# EAGLE schematic controller-ha-v4 (EAGLE 6.5.0)
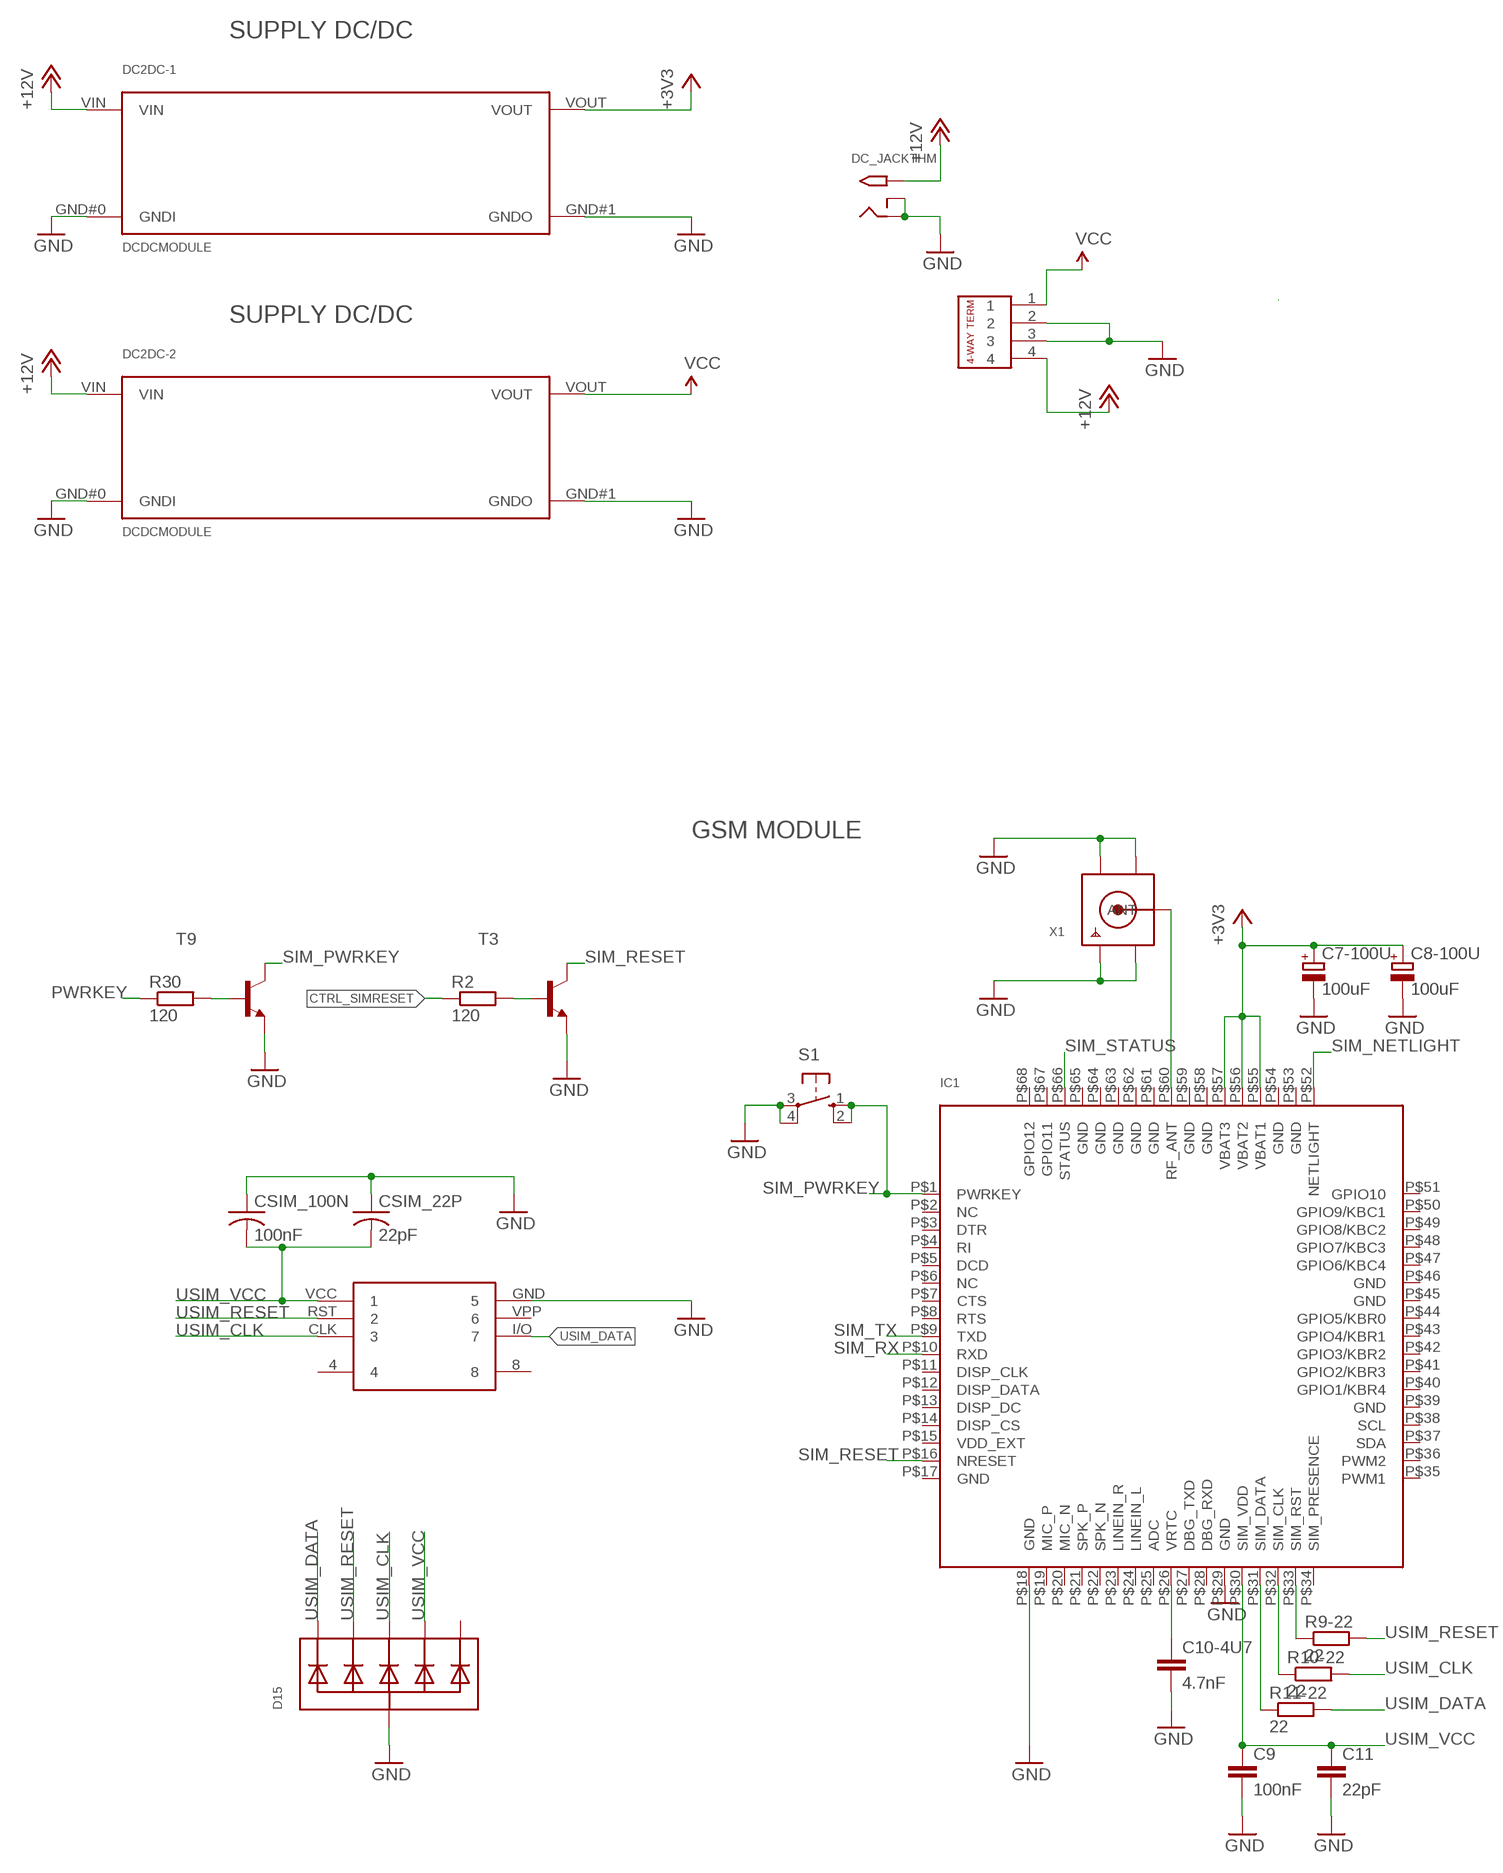
[diagram p0: schematic, sheet 1, part 1 of 2]
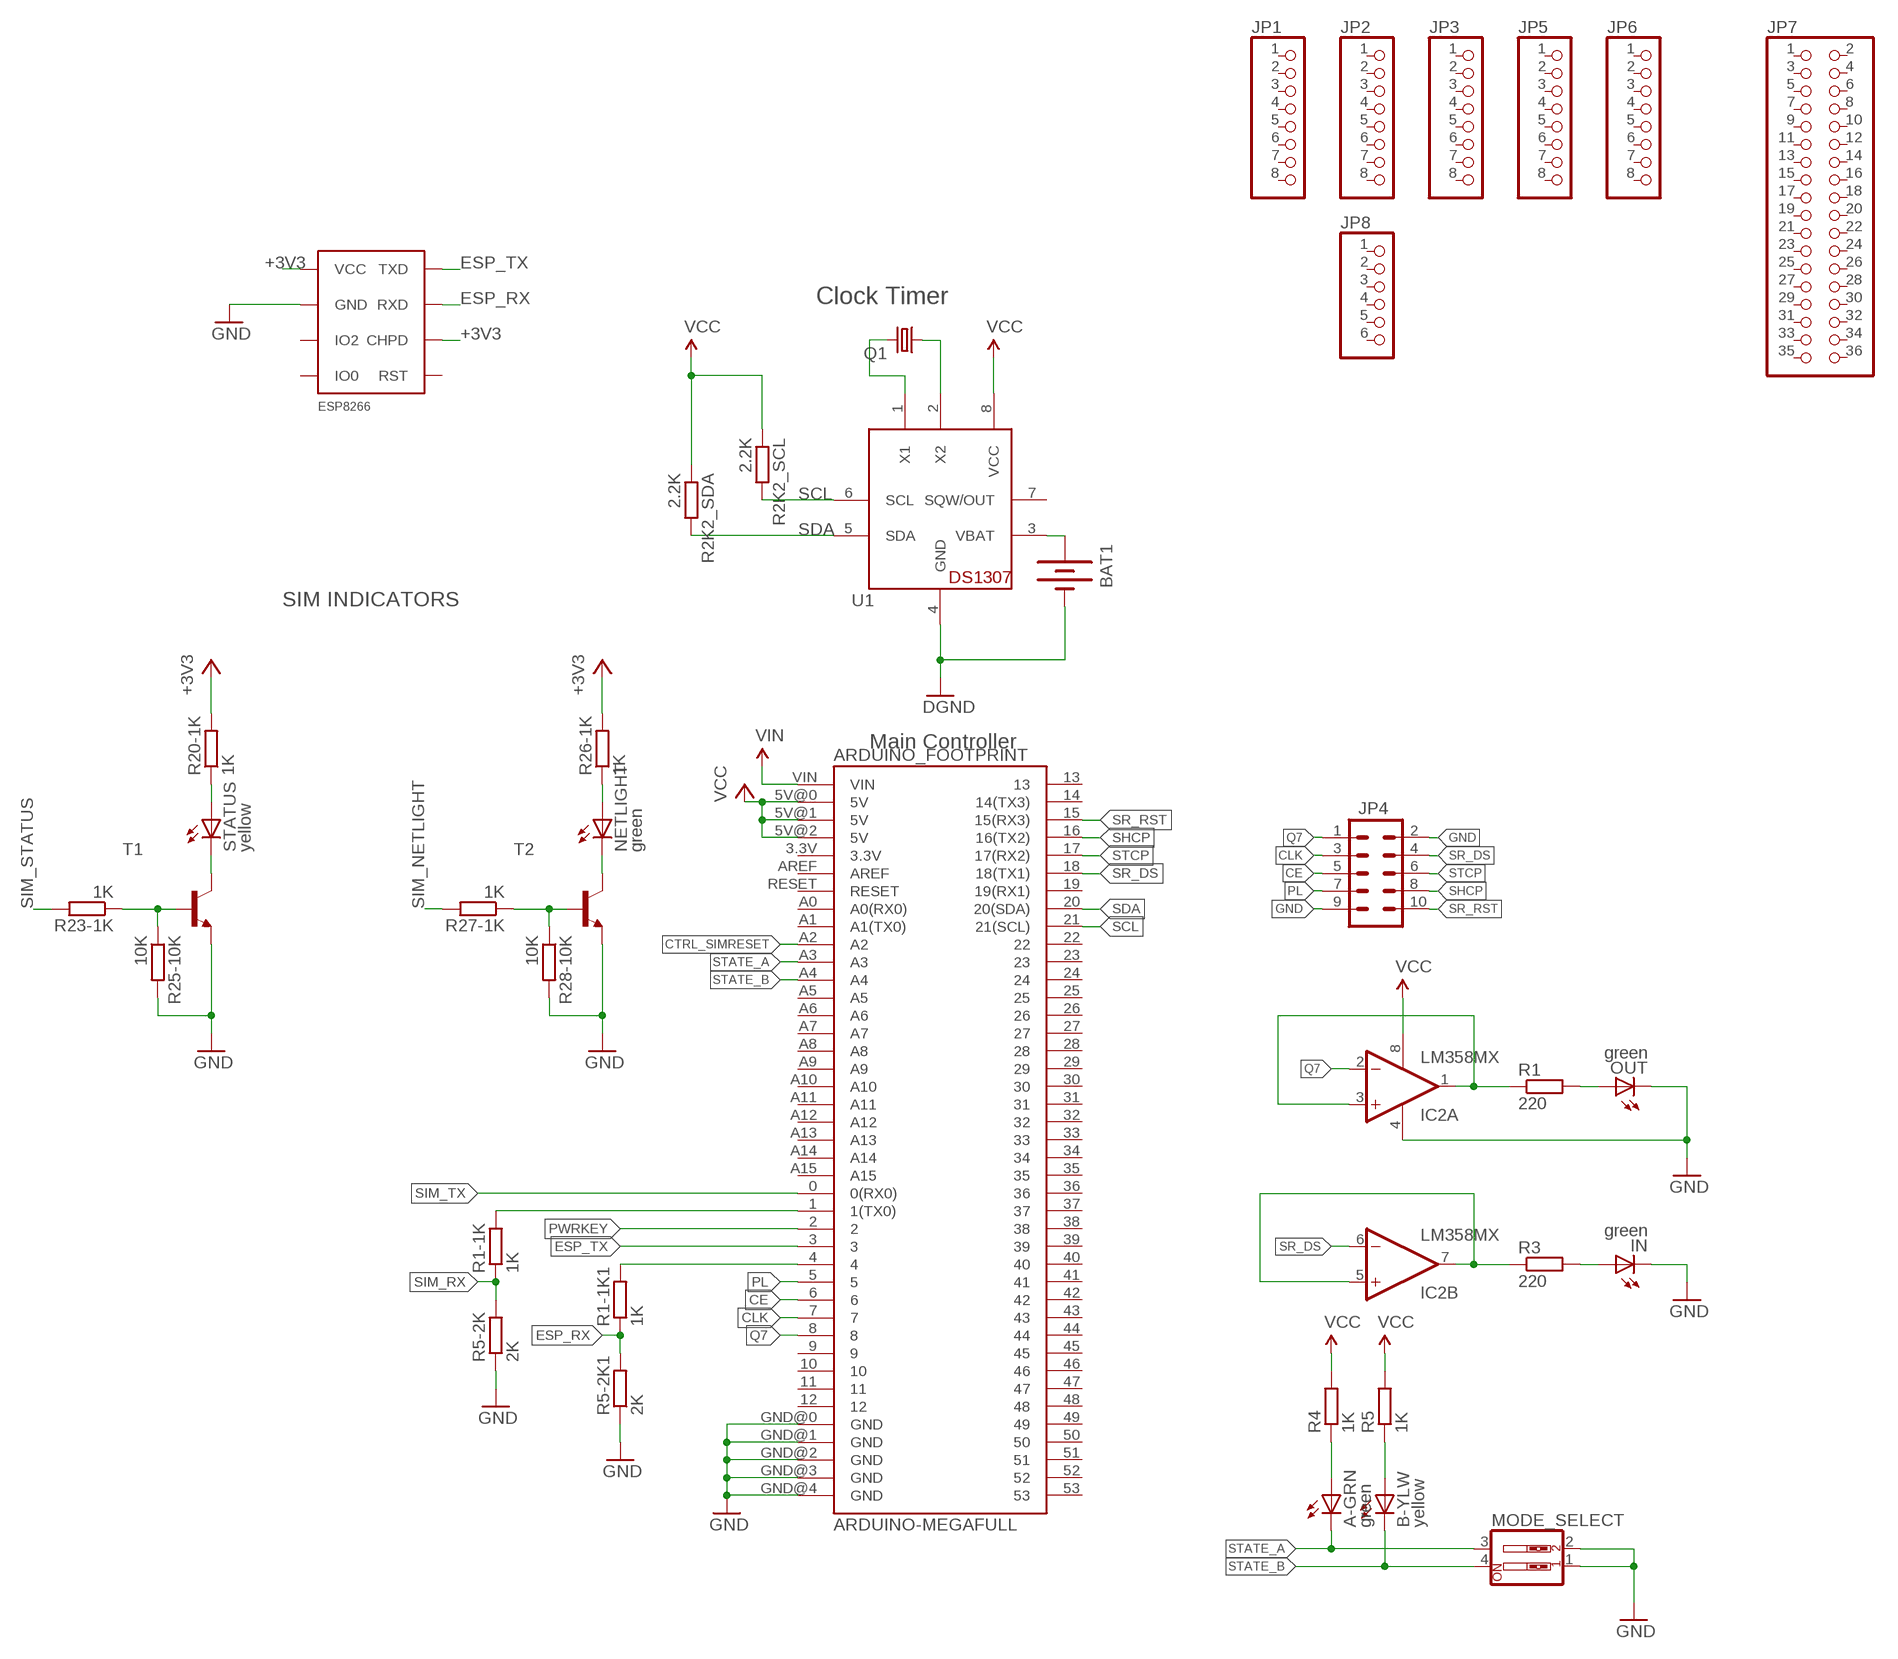
[diagram p1: schematic, sheet 1, part 2 of 2]

## Parts
4-WAY_L-TERMINAL  4-PIN-CON-1759017  [4-PIN-CON-1759017]
A-GRN  green  LEDCHIP-LED0805  [CHIP-LED0805]
ARDUINO_FOOTPRINT  ARDUINO-MEGAFULL  [ARDUINO_MEGA]
B-YLW  yellow  LEDCHIP-LED0805  [CHIP-LED0805]
BAT1  BATTERY20PTH  [BATTCOM_20MM_PTH]
C7-100U  100uF  CPOL-EU153CLV-0605  [153CLV-0605]
C8-100U  100uF  CPOL-EU153CLV-0605  [153CLV-0605]
C9  100nF  C-EUC0603  [C0603]
C10-4U7  4.7nF  C-EUC0603  [C0603]
C11  22pF  C-EUC0603  [C0603]
CSIM_22P  22pF  C-USC0603K  [C0603K]
CSIM_100N  100nF  C-USC0603K  [C0603K]
D15  TVSARRAY_5LANE  [SOT363]
DC2DC-1  DCDCMODULE  [DCDCMODULE]
DC2DC-2  DCDCMODULE  [DCDCMODULE]
DC_JACKTHM  2.1MMJACKTHM  [PJ-102A]
ESP8266  ESP8266  [ESP8266]
IC1  GSM_SIM900_LITERAL  [SIM900_SMT]
IC2  LM358MX  [SO08]
IN  green  LEDCHIPLED_0805  [CHIPLED_0805]
JP1  PINHD-1X8CLEANBIG  [1X08-CLEANBIG]
JP2  PINHD-1X8CLEANBIG  [1X08-CLEANBIG]
JP3  PINHD-1X8CLEANBIG  [1X08-CLEANBIG]
JP4  M05X2RA  [2X5-RA]
JP5  PINHD-1X8CLEANBIG  [1X08-CLEANBIG]
JP6  PINHD-1X8CLEANBIG  [1X08-CLEANBIG]
JP7  PINHD-2X18  [2X18]
JP8  PINHD-1X6CB  [1X06-CLEANBIG]
MODE_SELECT  SW_DIP-2  [EDG-02]
NETLIGHT  green  LEDCHIP-LED0805  [CHIP-LED0805]
OUT  green  LEDCHIPLED_0805  [CHIPLED_0805]
Q1  CRYSTALTC26H  [TC26H]
R1  220  R-EU_R0805  [R0805]
R1-1K  1K  R-EU_R0603  [R0603]
R1-1K1  1K  R-EU_R0603  [R0603]
R2  120  R-EU_M0805  [M0805]
R2K2_SCL  2.2K  R-EU_R0603  [R0603]
R2K2_SDA  2.2K  R-EU_R0603  [R0603]
R3  220  R-EU_R0805  [R0805]
R4  1K  R-EU_R0805  [R0805]
R5  1K  R-EU_R0805  [R0805]
R5-2K  2K  R-EU_R0603  [R0603]
R5-2K1  2K  R-EU_R0603  [R0603]
R9-22  22  R-EU_R0603  [R0603]
R10-22  22  R-EU_R0603  [R0603]
R11-22  22  R-EU_R0603  [R0603]
R20-1K  1K  R-EU_R0603  [R0603]
R23-1K  1K  R-EU_R0603  [R0603]
R25-10K  10K  R-EU_R0603  [R0603]
R26-1K  1K  R-EU_R0603  [R0603]
R27-1K  1K  R-EU_R0603  [R0603]
R28-10K  10K  R-EU_R0603  [R0603]
R30  120  R-EU_M0805  [M0805]
S1  10-XX  [B3F-10XX]
SIM_HOLDER  SIM_HOLDER_PUSH  [SIM_HOLDER_PUSH]
STATUS  yellow  LEDCHIP-LED0805  [CHIP-LED0805]
T1  MMBT2222ALT1-NPN-SOT23-BEC  [SOT23-BEC]
T2  MMBT2222ALT1-NPN-SOT23-BEC  [SOT23-BEC]
T3  MMBT2222ALT1-NPN-SOT23-BEC  [SOT23-BEC]
T9  MMBT2222ALT1-NPN-SOT23-BEC  [SOT23-BEC]
U1  DS1307  [DIL08]
X1  SMACONNECTOR  [SMA90_DIP]

## Nets
+3V3 [power]: C7-100U.+ C8-100U.+ DC2DC-1.VOUT ESP8266.CHPD ESP8266.VCC IC1.P$55(VBAT1) IC1.P$56(VBAT2) IC1.P$57(VBAT3) R20-1K.2 R26-1K.2
+12V [power]: 4-WAY_L-TERMINAL.4 DC2DC-1.VIN DC2DC-2.VIN DC_JACKTHM.TIP
CE: ARDUINO_FOOTPRINT.6 JP4.5
CLK: ARDUINO_FOOTPRINT.7 JP4.3
CTRL_SIMRESET: ARDUINO_FOOTPRINT.A2 R2.1
ESP_RX: ESP8266.RXD R1-1K1.1 R5-2K1.2
ESP_TX: ARDUINO_FOOTPRINT.3 ESP8266.TXD
GND [GND]: 4-WAY_L-TERMINAL.2 4-WAY_L-TERMINAL.3 ARDUINO_FOOTPRINT.GND@0(GND) ARDUINO_FOOTPRINT.GND@1(GND) ARDUINO_FOOTPRINT.GND@2(GND) ARDUINO_FOOTPRINT.GND@3(GND) ARDUINO_FOOTPRINT.GND@4(GND) BAT1.2(-) C7-100U.- C8-100U.- C9.2 C10-4U7.2 C11.2 CSIM_22P.1 CSIM_100N.1 D15.2(A) DC2DC-1.GND#0(GNDI) DC2DC-1.GND#1(GNDO) DC2DC-2.GND#0(GNDI) DC2DC-2.GND#1(GNDO) DC_JACKTHM.RING DC_JACKTHM.RING_SW ESP8266.GND IC1.P$18(GND) IC1.P$29(GND) IC2.4(P:V-) IN.C JP4.2 JP4.9 MODE_SELECT.1 MODE_SELECT.2 OUT.C R5-2K1.1 R5-2K.1 R25-10K.2 R28-10K.2 S1.3(P) S1.4(P1) SIM_HOLDER.GND T1.E T2.E T3.E T9.E U1.4(GND) X1.GND1 X1.GND2 X1.GND3 X1.GND4 ; supply symbol labelled DGND
N$1: ARDUINO_FOOTPRINT.1(1(TX0)) R1-1K.2
N$2: IC1.P$31(SIM_DATA) R11-22.1
N$3: IC1.P$32(SIM_CLK) R10-22.1
N$4: IC1.P$33(SIM_RST) R9-22.1
N$5: C10-4U7.1 IC1.P$26(VRTC)
N$6: IC1.P$60(RF_ANT) X1.ANTENNA(ANT)
N$8: R20-1K.1 STATUS.A
N$9: STATUS.C T1.C
N$10: R23-1K.1 R25-10K.1 T1.B
N$11: NETLIGHT.A R26-1K.1
N$12: NETLIGHT.C T2.C
N$13: R27-1K.1 R28-10K.1 T2.B
N$14: R30.2 T9.B
N$15: R2.2 T3.B
N$16: Q1.1 U1.2(X2)
N$19: Q1.2 U1.1(X1)
N$20: ARDUINO_FOOTPRINT.4 R1-1K1.2
N$21: IC2.1(A:OUT) IC2.3(A:+IN) R1.1
N$23: BAT1.1(+) U1.3(VBAT)
N$24: IC2.5(B:+IN) IC2.7(B:OUT) R3.1
N$25: OUT.A R1.2
N$26: IN.A R3.2
N$27: A-GRN.A R4.1
N$28: B-YLW.A R5.1
PL: ARDUINO_FOOTPRINT.5 JP4.7
PWRKEY: ARDUINO_FOOTPRINT.2 R30.1
Q7: ARDUINO_FOOTPRINT.8 IC2.2(A:-IN) JP4.1
SCL: ARDUINO_FOOTPRINT.21(21(SCL)) R2K2_SCL.2 U1.6(SCL)
SDA: ARDUINO_FOOTPRINT.20(20(SDA)) R2K2_SDA.2 U1.5(SDA)
SHCP: ARDUINO_FOOTPRINT.16(16(TX2)) JP4.8
SIM_NETLIGHT: IC1.P$52(NETLIGHT) R27-1K.2
SIM_PWRKEY: IC1.P$1(PWRKEY) S1.1(S) S1.2(S1) T9.C
SIM_RESET: IC1.P$16(NRESET) T3.C
SIM_RX: IC1.P$10(RXD) R1-1K.1 R5-2K.2
SIM_STATUS: IC1.P$66(STATUS) R23-1K.2
SIM_TX: ARDUINO_FOOTPRINT.0(0(RX0)) IC1.P$9(TXD)
SR_DS: ARDUINO_FOOTPRINT.18(18(TX1)) IC2.6(B:-IN) JP4.4
SR_RST: ARDUINO_FOOTPRINT.15(15(RX3)) JP4.10
STATE_A: A-GRN.C ARDUINO_FOOTPRINT.A3 MODE_SELECT.3
STATE_B: ARDUINO_FOOTPRINT.A4 B-YLW.C MODE_SELECT.4
STCP: ARDUINO_FOOTPRINT.17(17(RX2)) JP4.6
USIM_CLK: D15.4(C3) R10-22.2 SIM_HOLDER.CLK
USIM_DATA: D15.1(C1) R11-22.2 SIM_HOLDER.I/O
USIM_RESET: D15.3(C2) R9-22.2 SIM_HOLDER.RST
USIM_VCC: C9.1 C11.1 CSIM_22P.2 CSIM_100N.2 D15.5(C4) IC1.P$30(SIM_VDD) SIM_HOLDER.VCC
VCC [power]: 4-WAY_L-TERMINAL.1 ARDUINO_FOOTPRINT.5V@0(5V) ARDUINO_FOOTPRINT.5V@1(5V) ARDUINO_FOOTPRINT.5V@2(5V) DC2DC-2.VOUT IC2.8(P:V+) R2K2_SCL.1 R2K2_SDA.1 R4.2 R5.2 U1.8(VCC)
VIN: ARDUINO_FOOTPRINT.VIN
Unconnected: ARDUINO_FOOTPRINT.3.3V ARDUINO_FOOTPRINT.9 ARDUINO_FOOTPRINT.10 ARDUINO_FOOTPRINT.11 ARDUINO_FOOTPRINT.12 ARDUINO_FOOTPRINT.13 ARDUINO_FOOTPRINT.14(14(TX3)) ARDUINO_FOOTPRINT.19(19(RX1)) ARDUINO_FOOTPRINT.22 ARDUINO_FOOTPRINT.23 ARDUINO_FOOTPRINT.24 ARDUINO_FOOTPRINT.25 ARDUINO_FOOTPRINT.26 ARDUINO_FOOTPRINT.27 ARDUINO_FOOTPRINT.28 ARDUINO_FOOTPRINT.29 ARDUINO_FOOTPRINT.30 ARDUINO_FOOTPRINT.31 ARDUINO_FOOTPRINT.32 ARDUINO_FOOTPRINT.33 ARDUINO_FOOTPRINT.34 ARDUINO_FOOTPRINT.35 ARDUINO_FOOTPRINT.36 ARDUINO_FOOTPRINT.37 ARDUINO_FOOTPRINT.38 ARDUINO_FOOTPRINT.39 ARDUINO_FOOTPRINT.40 ARDUINO_FOOTPRINT.41 ARDUINO_FOOTPRINT.42 ARDUINO_FOOTPRINT.43 ARDUINO_FOOTPRINT.44 ARDUINO_FOOTPRINT.45 ARDUINO_FOOTPRINT.46 ARDUINO_FOOTPRINT.47 ARDUINO_FOOTPRINT.48 ARDUINO_FOOTPRINT.49 ARDUINO_FOOTPRINT.50 ARDUINO_FOOTPRINT.51 ARDUINO_FOOTPRINT.52 ARDUINO_FOOTPRINT.53 ARDUINO_FOOTPRINT.A0(A0(RX0)) ARDUINO_FOOTPRINT.A1(A1(TX0)) ARDUINO_FOOTPRINT.A5 ARDUINO_FOOTPRINT.A6 ARDUINO_FOOTPRINT.A7 ARDUINO_FOOTPRINT.A8 ARDUINO_FOOTPRINT.A9 ARDUINO_FOOTPRINT.A10 ARDUINO_FOOTPRINT.A11 ARDUINO_FOOTPRINT.A12 ARDUINO_FOOTPRINT.A13 ARDUINO_FOOTPRINT.A14 ARDUINO_FOOTPRINT.A15 ARDUINO_FOOTPRINT.AREF ARDUINO_FOOTPRINT.RESET D15.6(C5) ESP8266.IO0 ESP8266.IO2 ESP8266.RST IC1.P$2(NC) IC1.P$3(DTR) IC1.P$4(RI) IC1.P$5(DCD) IC1.P$6(NC) IC1.P$7(CTS) IC1.P$8(RTS) IC1.P$11(DISP_CLK) IC1.P$12(DISP_DATA) IC1.P$13(DISP_DC) IC1.P$14(DISP_CS) IC1.P$15(VDD_EXT) IC1.P$19(MIC_P) IC1.P$20(MIC_N) IC1.P$21(SPK_P) IC1.P$22(SPK_N) IC1.P$23(LINEIN_R) IC1.P$24(LINEIN_L) IC1.P$25(ADC) IC1.P$27(DBG_TXD) IC1.P$28(DBG_RXD) IC1.P$34(SIM_PRESENCE) IC1.P$35(PWM1) IC1.P$36(PWM2) IC1.P$37(SDA) IC1.P$38(SCL) IC1.P$40(GPIO1/KBR4) IC1.P$41(GPIO2/KBR3) IC1.P$42(GPIO3/KBR2) IC1.P$43(GPIO4/KBR1) IC1.P$44(GPIO5/KBR0) IC1.P$47(GPIO6/KBC4) IC1.P$48(GPIO7/KBC3) IC1.P$49(GPIO8/KBC2) IC1.P$50(GPIO9/KBC1) IC1.P$51(GPIO10) JP1.1 JP1.2 JP1.3 JP1.4 JP1.5 JP1.6 JP1.7 JP1.8 JP2.1 JP2.2 JP2.3 JP2.4 JP2.5 JP2.6 JP2.7 JP2.8 JP3.1 JP3.2 JP3.3 JP3.4 JP3.5 JP3.6 JP3.7 JP3.8 JP5.1 JP5.2 JP5.3 JP5.4 JP5.5 JP5.6 JP5.7 JP5.8 JP6.1 JP6.2 JP6.3 JP6.4 JP6.5 JP6.6 JP6.7 JP6.8 JP7.1 JP7.2 JP7.3 JP7.4 JP7.5 JP7.6 JP7.7 JP7.8 JP7.9 JP7.10 JP7.11 JP7.12 JP7.13 JP7.14 JP7.15 JP7.16 JP7.17 JP7.18 JP7.19 JP7.20 JP7.21 JP7.22 JP7.23 JP7.24 JP7.25 JP7.26 JP7.27 JP7.28 JP7.29 JP7.30 JP7.31 JP7.32 JP7.33 JP7.34 JP7.35 JP7.36 JP8.1 JP8.2 JP8.3 JP8.4 JP8.5 JP8.6 SIM_HOLDER.4 SIM_HOLDER.8 SIM_HOLDER.VPP U1.7(SQW/OUT)

## Notes on the sheet
- SUPPLY DC/DC
- SUPPLY DC/DC
- Clock Timer
- GSM MODULE
- SIM INDICATORS
- Main Controller

## Power pins joined to a net without a drawn wire
GND: IC1.P$17(GND) IC1.P$39(GND) IC1.P$45(GND) IC1.P$46(GND) IC1.P$53(GND) IC1.P$54(GND) IC1.P$58(GND) IC1.P$59(GND) IC1.P$61(GND) IC1.P$62(GND) IC1.P$63(GND) IC1.P$64(GND) IC1.P$65(GND)
GPIO11: IC1.P$67(GPIO11)
GPIO12: IC1.P$68(GPIO12)

## Library data of the parts
4-WAY_L-TERMINAL = maul:4-PIN-CON-1759017
A-GRN B-YLW = led:LED: LED
ARDUINO_FOOTPRINT = SparkFun-Boards:ARDUINO-MEGA: Arduino Mega board footprint
BAT1 = SparkFun-Electromechanical:BATTERY: Battery Holders Various common sizes : AA, AAA, 20mm coin cell and 12mm coin cell. 20MM_4LEGS, BATT-10373
C7-100U C8-100U = rcl:CPOL-EU: POLARIZED CAPACITOR, European symbol
C9 C10-4U7 C11 = rcl:C-EU: CAPACITOR, European symbol
CSIM_22P CSIM_100N = rcl:C-US: CAPACITOR, American symbol
D15 = microbuilder:TVSARRAY_5LANE: Voltage Transient Suppressor Array SOT363 SMF05C - 100W 5V: Digikey - SMF05CT1GOSCT-ND
DC2DC-1 DC2DC-2 = bontor:DCDCMODULE
DC_JACKTHM = adafruit:2.1MMJACK: 2.1mm x 5.5mm THM DC jack with internal switch. Digikey part #PJ-102A, 4UCON part #05537 2.1mm x 5.5mm SMT DC jack with internal switch. Digikey part #PJ-002A-SMT, 4UCON part #03267 By microbuilder.eu & adafruit.com
ESP8266 = tigorcustom:ESP8266
IC1 = microbuilder:GSM_SIM900_LITERAL: SIM900 Quad-Band GSM/GPRS Module Power Supply: 3.2-4.8V Temperature Range: -30°C-+80°C Bands: GSM 850, EGSM 900, DCS 1800, PCS 1900
IC2 = linear:LM358: OP AMP also LM158; LM258; LM2904 Source: http://cache.national.com/ds/LM/LM158.pdf
IN NETLIGHT OUT STATUS = adafruit:LED: LED
JP1-JP3 JP5 JP6 = adafruit:PINHD-1X8: PIN HEADER
JP4 = SparkFun-Connectors:M05X2: Header 5x2 Standard 10-pin dual row 0.1" header. Commonly used with AVR-ISP. Use with Spark Fun Electronics SKU: PRT-00778
JP7 = pinhead:PINHD-2X18: PIN HEADER
JP8 = adafruit:PINHD-1X6: PIN HEADER
MODE_SELECT = special:SW_DIP-2: DIP SWITCH
Q1 = crystal:CRYSTAL: CRYSTAL; OC_FARNELL: unknown; OC_NEWARK: unknown
R1-R5 R30 = resistor:R-EU_: RESISTOR, European symbol
R1-1K R1-1K1 R2K2_SCL R2K2_SDA R5-2K R5-2K1 R9-22 R10-22 R11-22 R20-1K R23-1K R25-10K R26-1K R27-1K R28-10K = rcl:R-EU_: RESISTOR, European symbol
S1 = switch-omron:10-XX: OMRON SWITCH; MPN: B3F-1000; OC_FARNELL: 176432; OC_NEWARK: 36M3542
SIM_HOLDER = maul:SIM_HOLDER_PUSH
T1 T2 = transistor:*-NPN-: NPN Transistror BF959 corrected 2008.03.06
T3 T9 = transistor-neu-to92:*-NPN-: NPN Transistror BF959 corrected 2008.03.06
U1 = adafruit:DS1307: DS1307 Real time clock (RTC) with battery backup ability. Talk to it via i2c
X1 = microbuilder:SMACONNECTOR: SMA Connector 90° DIP SMA Connector, 50 Ohm (4UConnector: 07259)

## Net classes
1 power: width 0.305 mm, drill 0.6 mm, clearance 0.813 mm
2 GND: width 0.305 mm, drill 0.6 mm, clearance 0.508 mm
3 LIVEAC: width 0.508 mm, drill 0.508 mm, clearance 1.27 mm